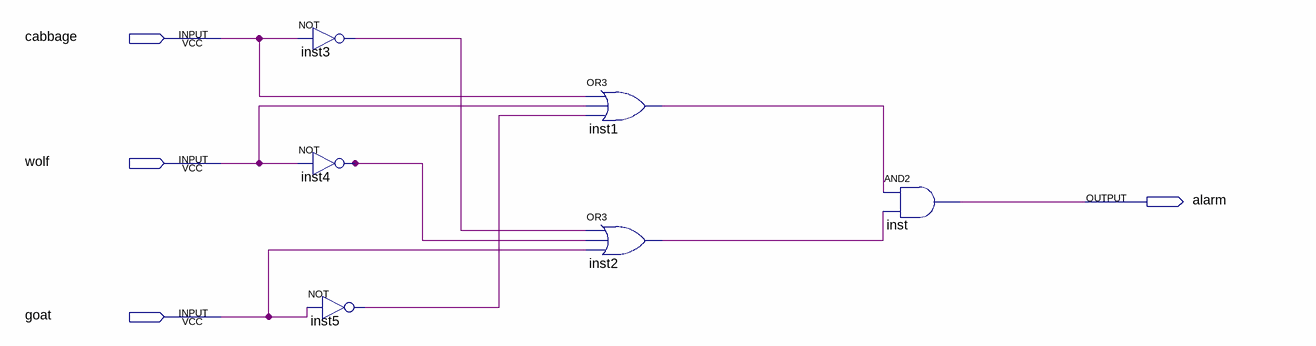
[diagram p0: schematic sheet]
// Quartus schematic lab3step0.bdf as structural Verilog: 6 symbols, 4 pins
module lab3step0 (
  input  cabbage,
  input  wolf,
  input  goat,
  output alarm
);

  wire inst1_out, inst2_out, inst3_out, inst4_out, inst5_out;

  not inst3 (inst3_out, cabbage);
  not inst4 (inst4_out, wolf);
  not inst5 (inst5_out, goat);
  or inst1 (inst1_out, cabbage, wolf, inst5_out);
  or inst2 (inst2_out, inst3_out, inst4_out, goat);
  and inst (alarm, inst1_out, inst2_out);
endmodule
